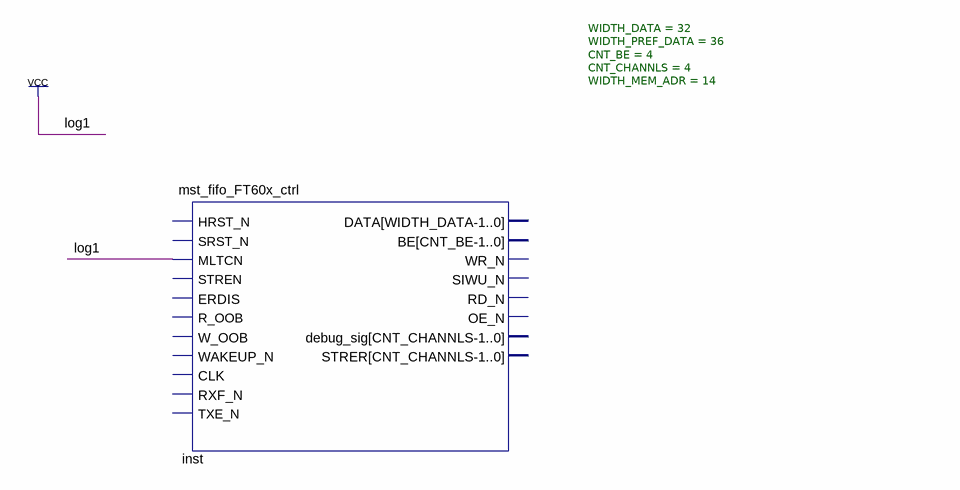
[diagram p0: schematic sheet]
// Quartus schematic Qua_ADC_to_FT601_x32_rev.bdf as structural Verilog: 1 symbols, 0 pins
module Qua_ADC_to_FT601_x32_rev (
);

  mst_fifo_FT60x_ctrl #(.WIDTH_DATA(32), .WIDTH_PREF_DATA(36), .CNT_BE(4), .CNT_CHANNLS(4), .WIDTH_MEM_ADR(14)) inst (.MLTCN(1'b1));  // open: HRST_N, SRST_N, STREN, ERDIS, R_OOB, W_OOB, WAKEUP_N, CLK, RXF_N, TXE_N, WR_N, SIWU_N, RD_N, OE_N, debug_sig, STRER, DATA, BE
endmodule
